# Altium schematic sheet NGFF_M2_KeyB_APCI0078-P002A.schdoc
size 46 x 126 mm
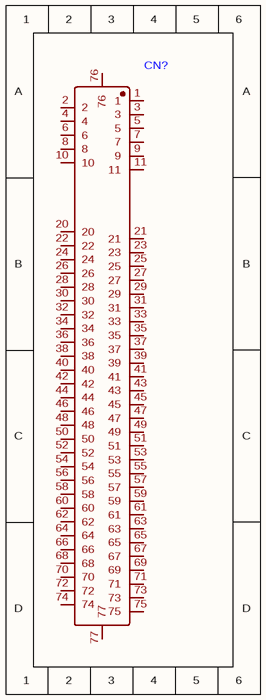
[diagram p0: NGFF_M2_KeyB_APCI0078-P002A.schdoc]

## Parts
CN?  (no value)  [NGFF-SMD_APCI0078-P002A]

## Nets

Not connected (* = marked no-connect by the designer): CN? 1 2 3 4 5 6 7 8 9 10 11 20 21 22 23 24 25 26 27 28 29 30 31 32 33 34 35 36 37 38 39 40 41 42 43 44 45 46 47 48 49 50 51 52 53 54 55 56 57 58 59 60 61 62 63 64 65 66 67 68 69 70 71 72 73 74 75 76 77

## Library data of the parts
CN? = APCI0078-P002A